# Altium schematic sheet hoja de conexiones.SchDoc
size A4
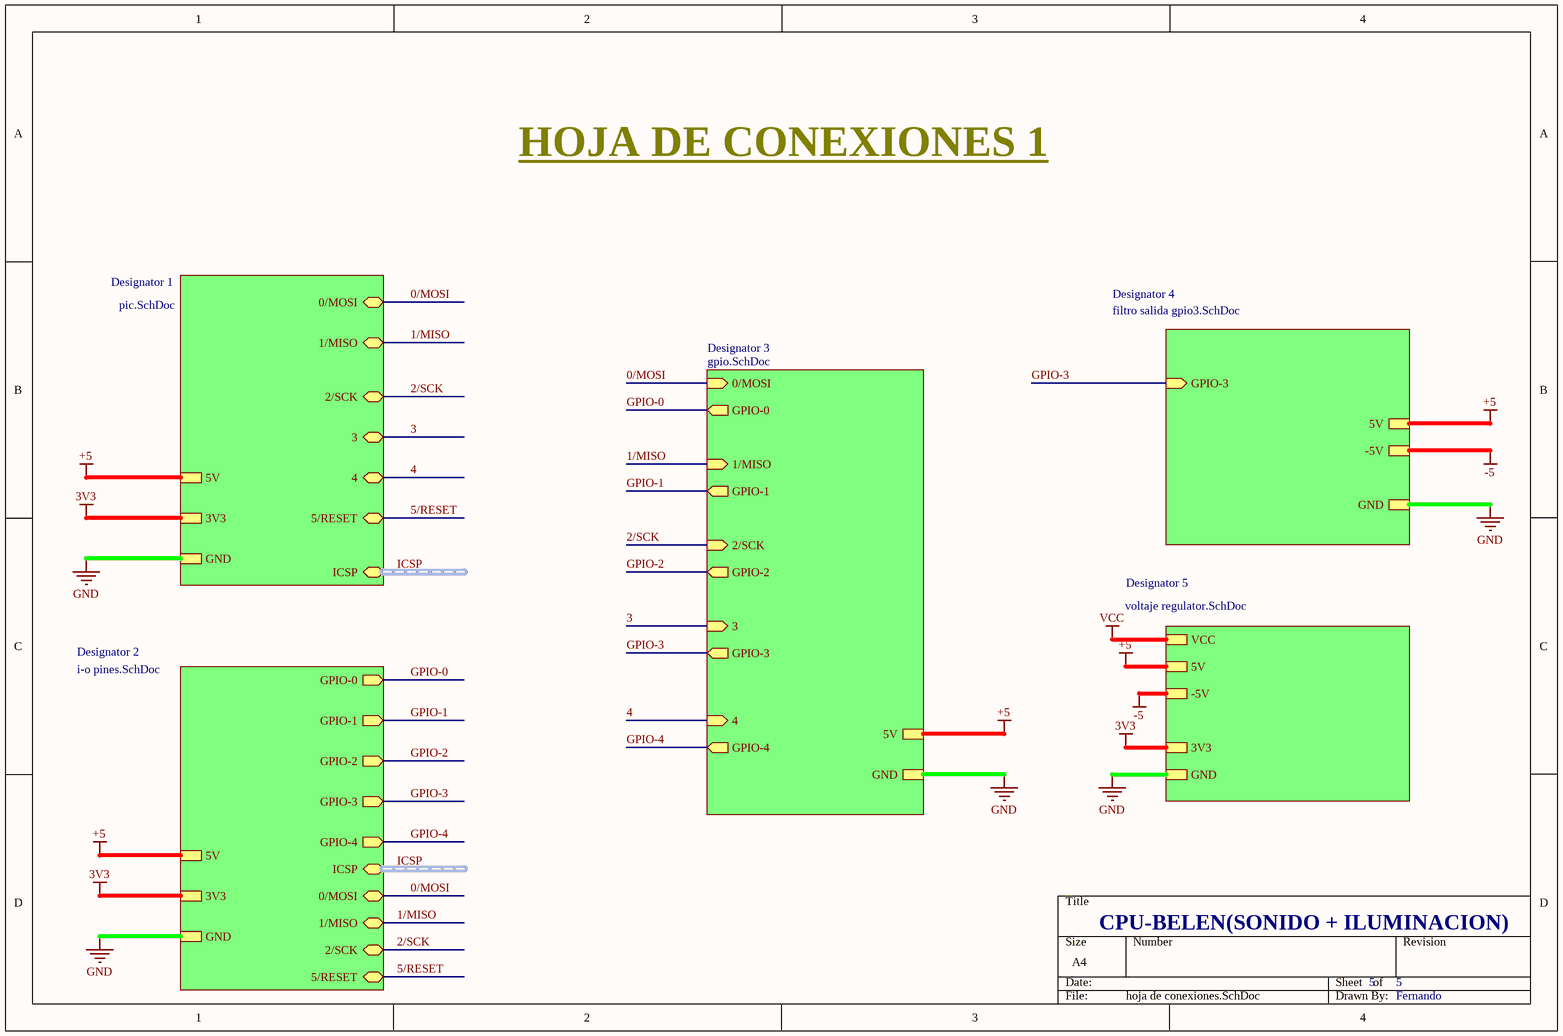
[diagram p0: hoja de conexiones.SchDoc]

## Sub-sheets
Designator 1 = pic.SchDoc: 0/MOSI (bidir), 1/MISO (bidir), 2/SCK (bidir), 3 (bidir), 4 (bidir), 5/RESET (bidir), 3V3, GND, 5V, ICSP (bidir, harness ICSP)
Designator 2 = i-o pines.SchDoc: GPIO-2 (out), GPIO-3 (out), GPIO-0 (out), GPIO-1 (out), GPIO-4 (out), GND, 3V3, 5V, 1/MISO (bidir), 2/SCK (bidir), 5/RESET (bidir), 0/MOSI (bidir), ICSP (bidir, harness ICSP)
Designator 3 = gpio.SchDoc: 0/MOSI (in), GPIO-0 (out), 1/MISO (in), GPIO-1 (out), 2/SCK (in), GPIO-2 (out), 3 (in), GPIO-3 (out), 4 (in), GPIO-4 (out), GND, 5V
Designator 4 = filtro salida gpio3.SchDoc: GPIO-3 (in), GND, -5V, 5V
Designator 5 = voltaje regulator.SchDoc: VCC, 5V, -5V, 3V3, GND

## Nets
3V3: sheet Designator 1/3V3, sheet Designator 2/3V3, sheet Designator 5/3V3
+5: sheet Designator 1/5V, sheet Designator 3/5V, sheet Designator 4/5V, sheet Designator 2/5V, sheet Designator 5/5V
-5: sheet Designator 4/-5V, sheet Designator 5/-5V
GND: sheet Designator 1/GND, sheet Designator 3/GND, sheet Designator 4/GND, sheet Designator 2/GND, sheet Designator 5/GND
VCC: sheet Designator 5/VCC
0/MOSI: sheet Designator 1/0/MOSI, sheet Designator 3/0/MOSI, sheet Designator 2/0/MOSI
1/MISO: sheet Designator 1/1/MISO, sheet Designator 3/1/MISO, sheet Designator 2/1/MISO
2/SCK: sheet Designator 1/2/SCK, sheet Designator 3/2/SCK, sheet Designator 2/2/SCK
3: sheet Designator 1/3, sheet Designator 3/3
4: sheet Designator 1/4, sheet Designator 3/4
5/RESET: sheet Designator 1/5/RESET, sheet Designator 2/5/RESET
GPIO-0: sheet Designator 3/GPIO-0, sheet Designator 2/GPIO-0
GPIO-1: sheet Designator 3/GPIO-1, sheet Designator 2/GPIO-1
GPIO-2: sheet Designator 3/GPIO-2, sheet Designator 2/GPIO-2
GPIO-3: sheet Designator 3/GPIO-3, sheet Designator 4/GPIO-3, sheet Designator 2/GPIO-3
GPIO-4: sheet Designator 3/GPIO-4, sheet Designator 2/GPIO-4

## Buses and harness runs
harness ICSP = sheet Designator 1/ICSP
harness ICSP = sheet Designator 2/ICSP

## Notes on the sheet
- HOJA DE CONEXIONES 1
- CPU-BELEN(SONIDO + ILUMINACION)
- 5
- Fernando